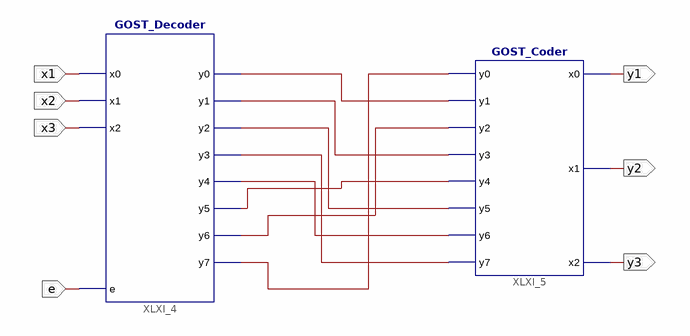
[diagram p0: schematic sheet 1]
// Xilinx ISE schematic Sboxgostschem.sch (kintex7) as structural Verilog: 2 symbols, 7 ports
module Sboxgostschem (
  input  e,
  input  x3,
  input  x2,
  input  x1,
  output y2,
  output y1,
  output y3
);

  wire XLXN_15, XLXN_16, XLXN_17, XLXN_18, XLXN_19, XLXN_20, XLXN_21, XLXN_22;

  GOST_Decoder XLXI_4 (
    .x0(x1), .x1(x2), .x2(x3), .e(e), .y0(XLXN_15), .y1(XLXN_16), .y2(XLXN_17), .y3(XLXN_18), .y4(XLXN_19),
    .y5(XLXN_20), .y6(XLXN_21), .y7(XLXN_22));
  GOST_Coder XLXI_5 (
    .y0(XLXN_22), .y1(XLXN_15), .y2(XLXN_21), .y3(XLXN_16), .y4(XLXN_20), .y5(XLXN_17), .y6(XLXN_19),
    .y7(XLXN_18), .x0(y1), .x1(y2), .x2(y3));
endmodule
